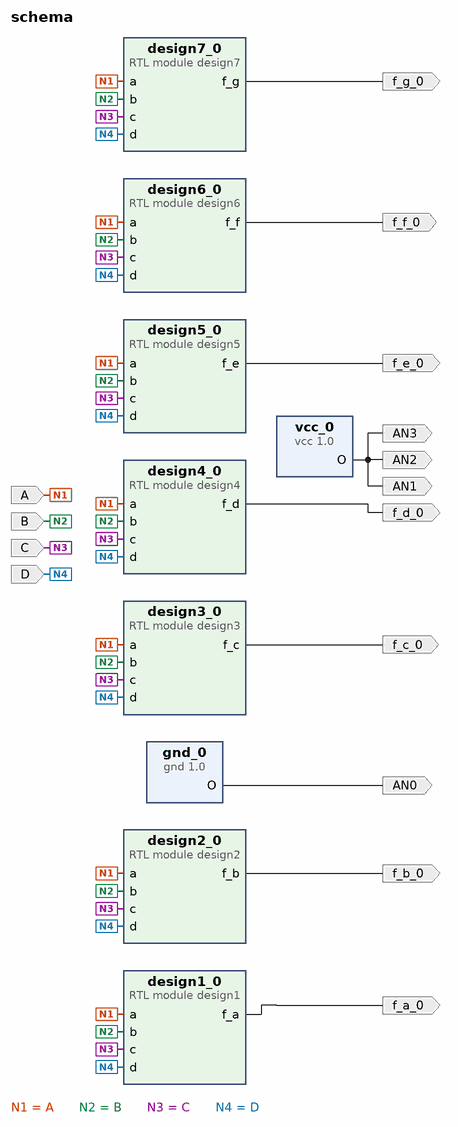
[diagram p0: block diagram of the top level]
# Vivado block design schema, xc7a35tcpg236-1, Vivado 2018.2
create_bd_design schema

create_bd_port -dir I A
create_bd_port -dir I B
create_bd_port -dir I C
create_bd_port -dir I D
create_bd_port -dir O f_a_0
create_bd_port -dir O f_b_0
create_bd_port -dir O f_c_0
create_bd_port -dir O f_d_0
create_bd_port -dir O f_e_0
create_bd_port -dir O f_f_0
create_bd_port -dir O f_g_0
create_bd_port -dir O AN0
create_bd_port -dir O AN1
create_bd_port -dir O AN2
create_bd_port -dir O AN3

create_bd_cell -type module -reference design1 design1_0
create_bd_cell -type module -reference design2 design2_0
create_bd_cell -type module -reference design3 design3_0
create_bd_cell -type module -reference design4 design4_0
create_bd_cell -type module -reference design5 design5_0
create_bd_cell -type module -reference design6 design6_0
create_bd_cell -type module -reference design7 design7_0
create_bd_cell -type ip -vlnv FIT:user:gnd:1.0 gnd_0
create_bd_cell -type ip -vlnv FIT:user:vcc:1.0 vcc_0

# ---- connections ----

connect_bd_net [get_bd_ports A] \
  [get_bd_pins design1_0/a] [get_bd_pins design2_0/a] [get_bd_pins design3_0/a] [get_bd_pins design4_0/a] \
  [get_bd_pins design5_0/a] [get_bd_pins design6_0/a] [get_bd_pins design7_0/a]
connect_bd_net [get_bd_ports B] \
  [get_bd_pins design1_0/b] [get_bd_pins design2_0/b] [get_bd_pins design3_0/b] [get_bd_pins design4_0/b] \
  [get_bd_pins design5_0/b] [get_bd_pins design6_0/b] [get_bd_pins design7_0/b]
connect_bd_net [get_bd_ports C] \
  [get_bd_pins design1_0/c] [get_bd_pins design2_0/c] [get_bd_pins design3_0/c] [get_bd_pins design4_0/c] \
  [get_bd_pins design5_0/c] [get_bd_pins design6_0/c] [get_bd_pins design7_0/c]
connect_bd_net [get_bd_ports D] \
  [get_bd_pins design1_0/d] [get_bd_pins design2_0/d] [get_bd_pins design3_0/d] [get_bd_pins design4_0/d] \
  [get_bd_pins design5_0/d] [get_bd_pins design6_0/d] [get_bd_pins design7_0/d]
connect_bd_net [get_bd_pins design7_0/f_g] [get_bd_ports f_g_0]
connect_bd_net [get_bd_pins design6_0/f_f] [get_bd_ports f_f_0]
connect_bd_net [get_bd_pins design5_0/f_e] [get_bd_ports f_e_0]
connect_bd_net [get_bd_pins design4_0/f_d] [get_bd_ports f_d_0]
connect_bd_net [get_bd_pins design3_0/f_c] [get_bd_ports f_c_0]
connect_bd_net [get_bd_pins design2_0/f_b] [get_bd_ports f_b_0]
connect_bd_net [get_bd_pins design1_0/f_a] [get_bd_ports f_a_0]
connect_bd_net [get_bd_pins gnd_0/O] [get_bd_ports AN0]
connect_bd_net [get_bd_pins vcc_0/O] [get_bd_ports AN1] [get_bd_ports AN3] [get_bd_ports AN2]

validate_bd_design
save_bd_design
